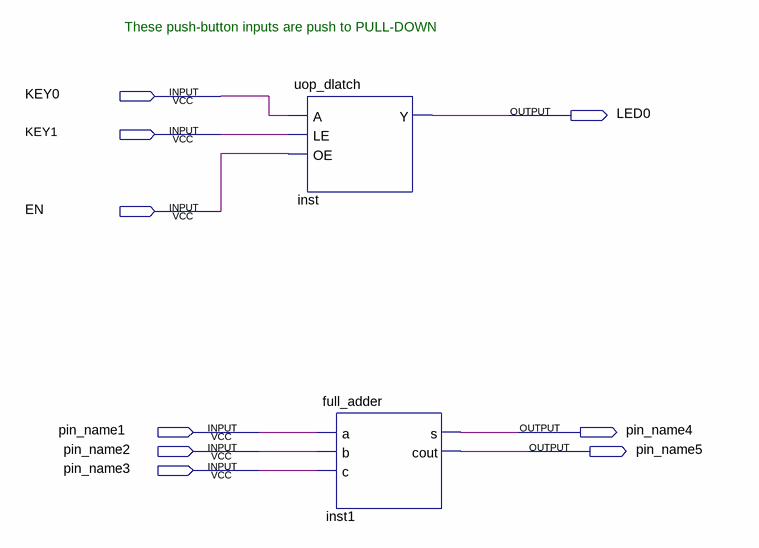
[diagram p0: schematic sheet]
// Quartus schematic comb_logic.bdf as structural Verilog: 2 symbols, 9 pins
module comb_logic (
  input  KEY0,
  input  KEY1,
  input  EN,
  input  pin_name1,
  input  pin_name2,
  input  pin_name3,
  output LED0,
  output pin_name4,
  output pin_name5
);

  uop_dlatch inst (.A(KEY0), .LE(KEY1), .OE(EN), .Y(LED0));
  full_adder inst1 (.a(pin_name1), .b(pin_name2), .c(pin_name3), .s(pin_name4), .cout(pin_name5));

  // Notes on the sheet:
  //   These push-button inputs are push to PULL-DOWN
endmodule
